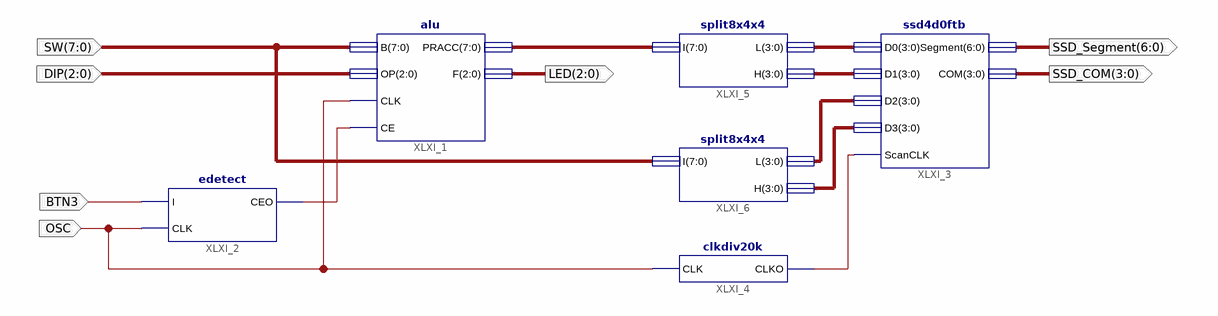
[diagram p0: schematic sheet 1]
// Xilinx ISE schematic main.sch (spartan6) as structural Verilog: 6 symbols, 7 ports
module main (
  input  OSC,
  input  BTN3,
  input  [7:0] SW,
  input  [2:0] DIP,
  output [2:0] LED,
  output [3:0] SSD_COM,
  output [6:0] SSD_Segment
);

  wire XLXN_2, XLXN_12;
  wire [3:0] XLXN_15, XLXN_16, XLXN_32, XLXN_33;
  wire [7:0] XLXN_9;

  alu XLXI_1 (.B(SW), .CE(XLXN_2), .CLK(OSC), .F(LED), .OP(DIP), .PRACC(XLXN_9));
  edetect XLXI_2 (.CEO(XLXN_2), .CLK(OSC), .I(BTN3));
  ssd4d0ftb XLXI_3 (
    .COM(SSD_COM), .D0(XLXN_16), .D1(XLXN_15), .D2(XLXN_32), .D3(XLXN_33), .ScanCLK(XLXN_12),
    .Segment(SSD_Segment));
  clkdiv20k XLXI_4 (.CLK(OSC), .CLKO(XLXN_12));
  split8x4x4 XLXI_5 (.H(XLXN_15), .I(XLXN_9), .L(XLXN_16));
  split8x4x4 XLXI_6 (.H(XLXN_33), .I(SW), .L(XLXN_32));
endmodule
